# Altium schematic sheet 01 - Notes.SchDoc: 25kW WolfPACK FM3 Six-Pack Inverter
size 431 x 279 mm; Date: 01/2024; DocumentNumber: CRD25DA12N-FMC; Revision: 1.2; SheetNumber: 1; SheetTotal: 8; SheetSize: B
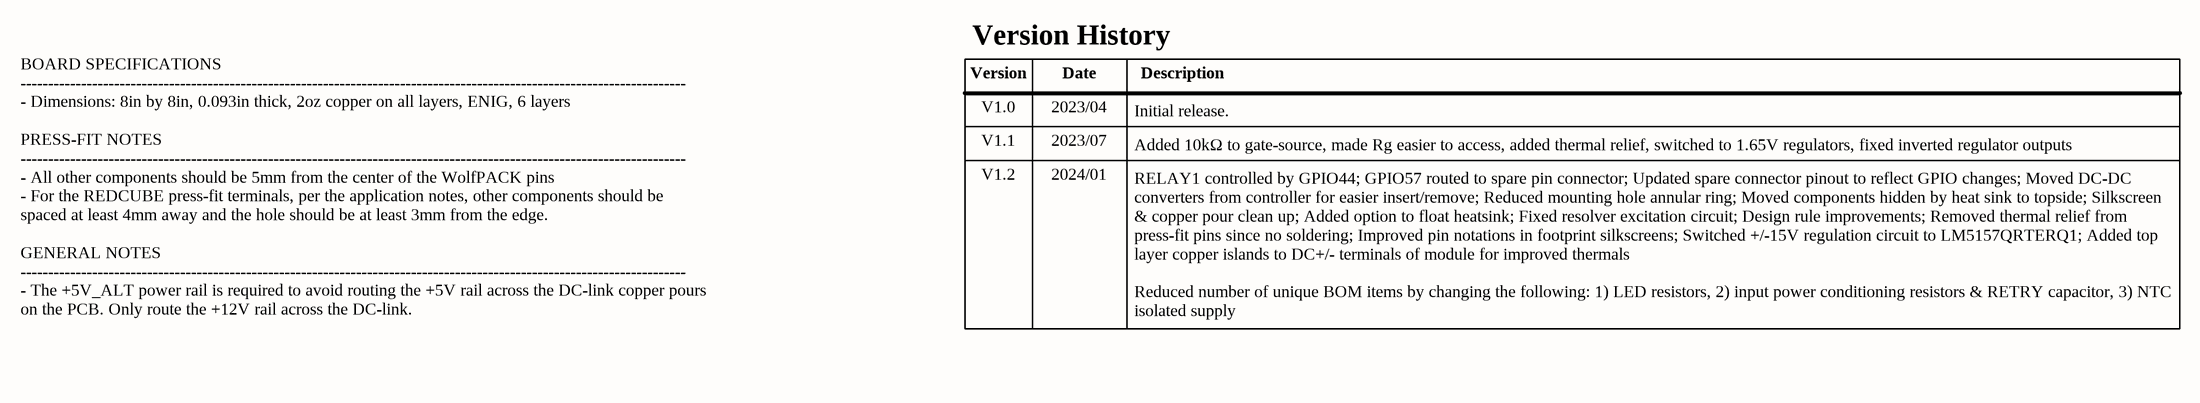
[diagram p0: 01 - Notes.SchDoc]

## Notes on the sheet
- Version History
- Version
- Date
- Description
- V1.0
- V1.1
- 2023/04
- 2023/07
- Initial release.
- Added 10kΩ to gate-source, made Rg easier to access, added thermal relief, switched to 1.65V regulators, fixed inverted regulator outputs
- V1.2
- 2024/01
- RELAY1 controlled by GPIO44; GPIO57 routed to spare pin connector; Updated spare connector pinout to reflect GPIO changes; Moved DC-DC converters from controller for easier insert/remove; Reduced mounting hole annular ring; Moved components hidden by heat sink to topside; Silkscreen & copper pour clean up; Added option to float heatsink; Fixed resolver excitation circuit; Design rule improvements; Removed thermal relief from press-fit pins since no soldering; Improved pin notations in footprint silkscreens; Switched +/-15V regulation circuit to LM5157QRTERQ1; Added top layer copper islands to DC+/- terminals of module for improved thermals
  Reduced number of unique BOM items by changing the following: 1) LED resistors, 2) input power conditioning resistors & RETRY capacitor, 3) NTC isolated supply
- BOARD SPECIFICATIONS
  -------------------------------------------------------------------------------------------------------------------------
  - Dimensions: 8in by 8in, 0.093in thick, 2oz copper on all layers, ENIG, 6 layers
  PRESS-FIT NOTES
  -------------------------------------------------------------------------------------------------------------------------
  - All other components should be 5mm from the center of the WolfPACK pins
  - For the REDCUBE press-fit terminals, per the application notes, other components should be spaced at least 4mm away and the hole should be at least 3mm from the edge.
  GENERAL NOTES
  -------------------------------------------------------------------------------------------------------------------------
  - The +5V_ALT power rail is required to avoid routing the +5V rail across the DC-link copper pours on the PCB. Only route the +12V rail across the DC-link.
- Title:
- Date:
- Drawing No:
- Size:
- Revision:
- Sheet:
- of